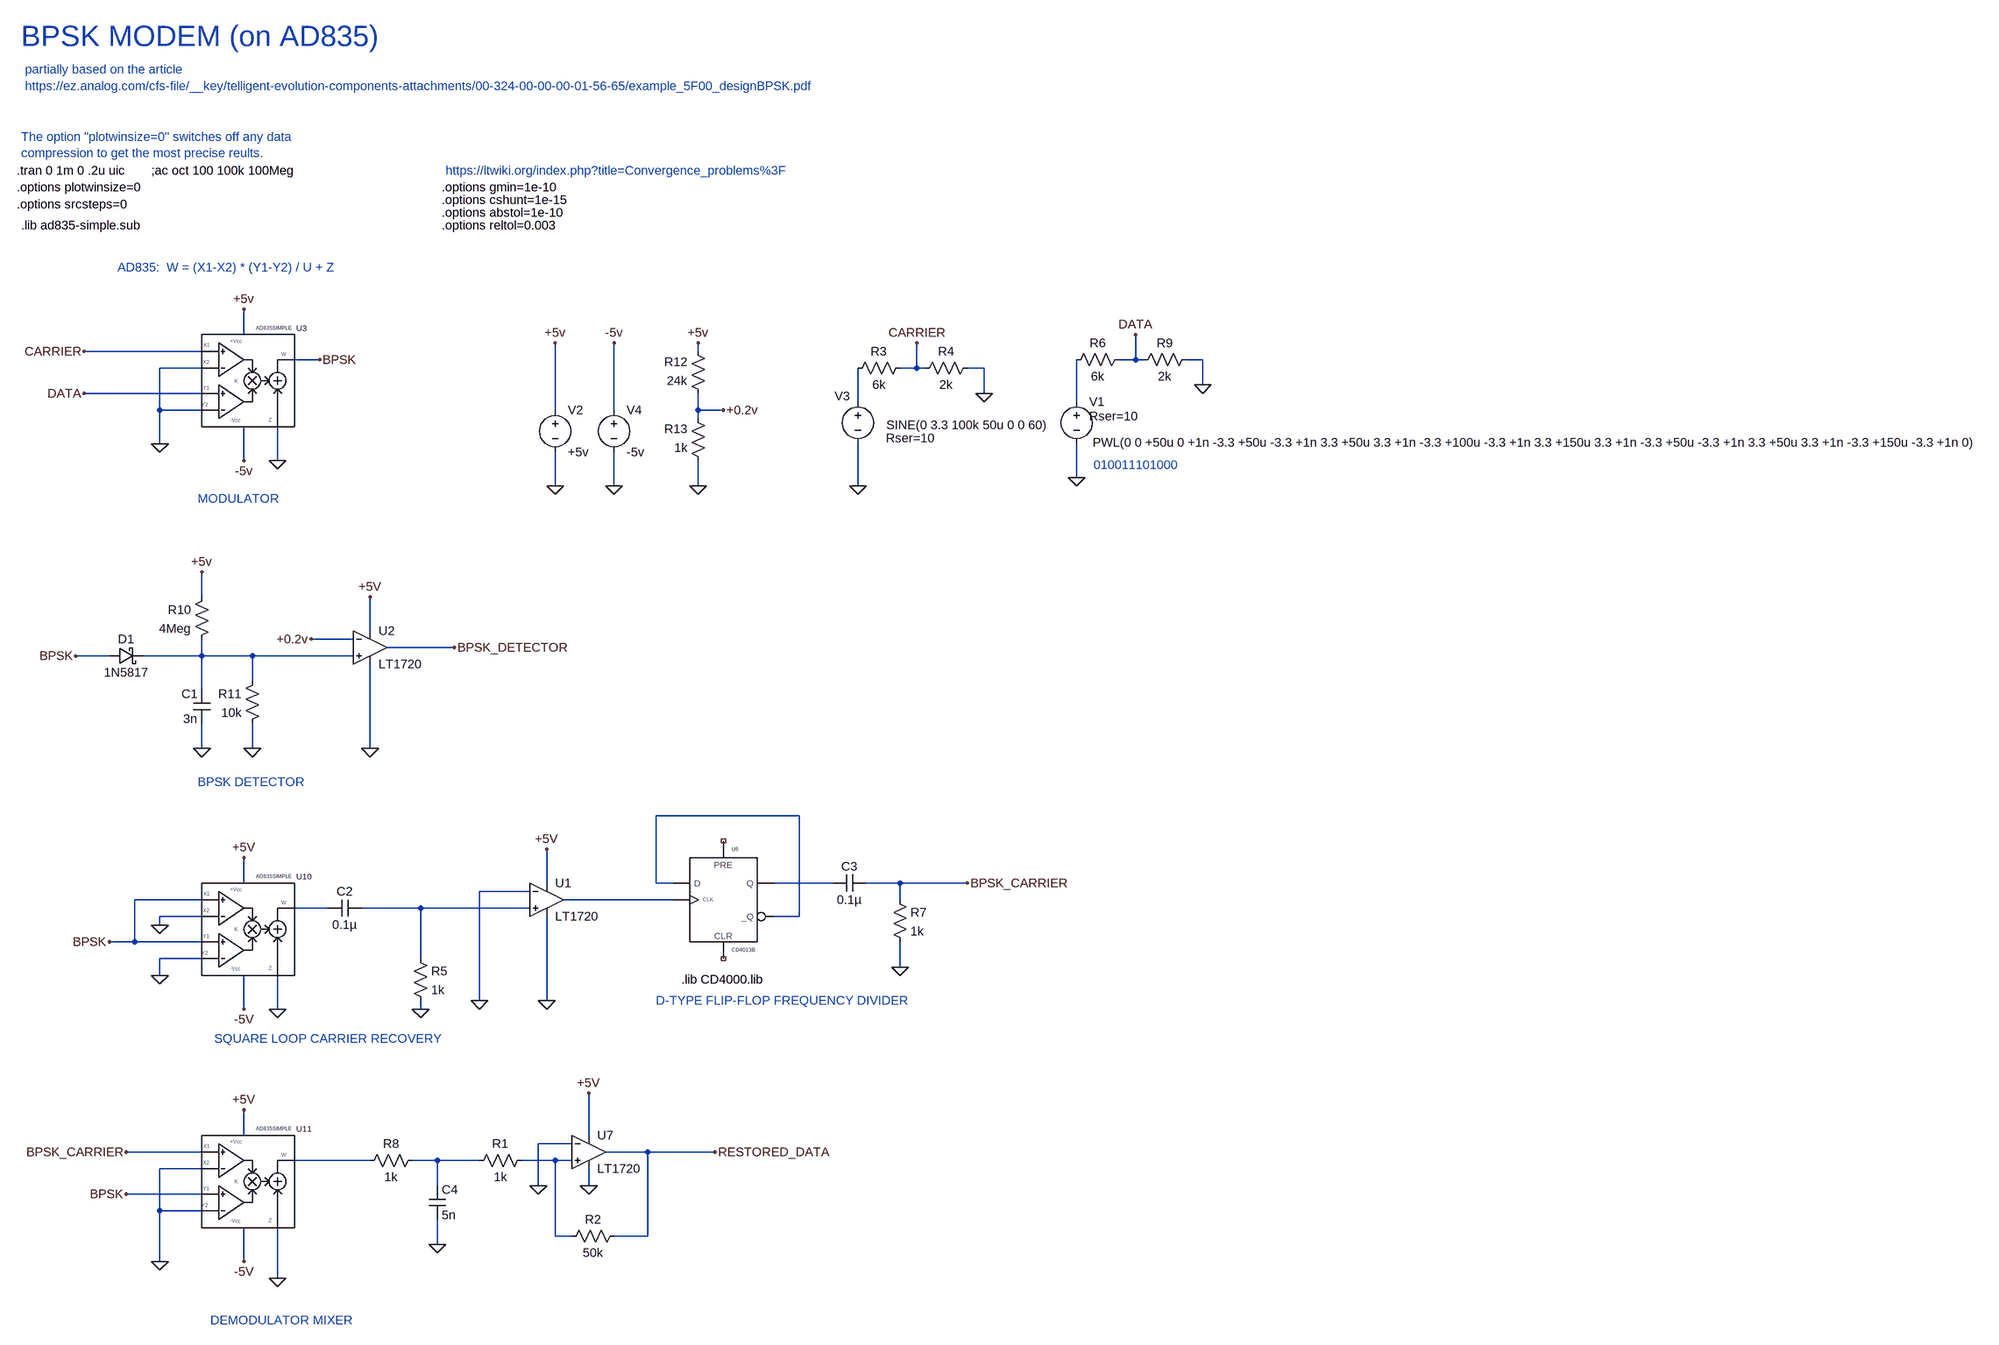
[diagram p0: schematic BPSK-modem-AD835.asc]
BPSK-modem-AD835.asc, the LTspice schematic file:
Version 4
SHEET 1 2952 2612
WIRE -704 416 -704 368
WIRE -784 448 -1008 448
WIRE 160 448 160 432
WIRE -560 464 -608 464
WIRE 992 464 992 416
WIRE 992 464 960 464
WIRE 1008 464 992 464
WIRE 1120 464 1088 464
WIRE -784 480 -864 480
WIRE 576 480 576 432
WIRE 576 480 544 480
WIRE 592 480 576 480
WIRE 704 480 672 480
WIRE 1120 512 1120 464
WIRE -784 528 -1008 528
WIRE 704 528 704 480
WIRE 464 544 464 480
WIRE 880 544 880 464
WIRE -864 560 -864 480
WIRE -784 560 -864 560
WIRE -112 560 -112 432
WIRE 0 560 0 432
WIRE 160 560 160 528
WIRE 208 560 160 560
WIRE 160 576 160 560
WIRE -864 624 -864 560
WIRE -704 656 -704 592
WIRE -640 656 -640 592
WIRE 880 688 880 624
WIRE -112 704 -112 640
WIRE 0 704 0 640
WIRE 160 704 160 656
WIRE 464 704 464 624
WIRE -784 944 -784 896
WIRE -464 1008 -464 944
WIRE -496 1024 -576 1024
WIRE -304 1040 -432 1040
WIRE -960 1056 -1024 1056
WIRE -784 1056 -784 1024
WIRE -784 1056 -896 1056
WIRE -688 1056 -784 1056
WIRE -496 1056 -688 1056
WIRE -688 1104 -688 1056
WIRE -784 1120 -784 1056
WIRE -784 1232 -784 1184
WIRE -688 1232 -688 1184
WIRE -464 1232 -464 1072
WIRE 352 1360 80 1360
WIRE -704 1488 -704 1440
WIRE -128 1488 -128 1424
WIRE 80 1488 80 1360
WIRE 112 1488 80 1488
WIRE 416 1488 304 1488
WIRE 544 1488 480 1488
WIRE 672 1488 544 1488
WIRE -160 1504 -256 1504
WIRE -784 1520 -912 1520
WIRE 112 1520 -96 1520
WIRE 544 1520 544 1488
WIRE -544 1536 -608 1536
WIRE -368 1536 -480 1536
WIRE -160 1536 -368 1536
WIRE -784 1552 -864 1552
WIRE 352 1552 352 1360
WIRE 352 1552 304 1552
WIRE -864 1568 -864 1552
WIRE -912 1600 -912 1520
WIRE -912 1600 -960 1600
WIRE -784 1600 -912 1600
WIRE -784 1632 -864 1632
WIRE -368 1632 -368 1536
WIRE 544 1648 544 1600
WIRE -864 1664 -864 1632
WIRE -256 1712 -256 1504
WIRE -128 1712 -128 1552
WIRE -704 1728 -704 1664
WIRE -640 1728 -640 1664
WIRE -368 1728 -368 1712
WIRE -704 1968 -704 1920
WIRE -48 1968 -48 1888
WIRE -80 1984 -144 1984
WIRE -784 2000 -928 2000
WIRE 64 2000 -16 2000
WIRE 192 2000 64 2000
WIRE -464 2016 -608 2016
WIRE -336 2016 -384 2016
WIRE -256 2016 -336 2016
WIRE -112 2016 -176 2016
WIRE -80 2016 -112 2016
WIRE -784 2032 -864 2032
WIRE -336 2064 -336 2016
WIRE -144 2064 -144 1984
WIRE -48 2064 -48 2032
WIRE -784 2080 -928 2080
WIRE -864 2112 -864 2032
WIRE -784 2112 -864 2112
WIRE -112 2160 -112 2016
WIRE -80 2160 -112 2160
WIRE 64 2160 64 2000
WIRE 64 2160 0 2160
WIRE -336 2176 -336 2128
WIRE -864 2208 -864 2112
WIRE -704 2208 -704 2144
WIRE -640 2240 -640 2144
FLAG -704 368 +5v
FLAG -704 656 -5v
FLAG -864 624 0
FLAG -560 464 BPSK
FLAG -640 656 0
FLAG -112 704 0
FLAG -112 432 +5v
FLAG 0 432 -5v
FLAG 0 704 0
FLAG 464 704 0
FLAG 880 688 0
FLAG -1008 448 CARRIER
FLAG -1008 528 DATA
FLAG -704 1440 +5V
FLAG -704 1728 -5V
FLAG -960 1600 BPSK
FLAG -256 1712 0
FLAG -128 1712 0
FLAG -128 1424 +5V
FLAG -368 1728 0
FLAG -640 2240 0
FLAG -864 2208 0
FLAG -928 2000 BPSK_CARRIER
FLAG -928 2080 BPSK
FLAG -704 2208 -5V
FLAG -704 1920 +5V
FLAG 544 1648 0
FLAG 672 1488 BPSK_CARRIER
FLAG -336 2176 0
FLAG -144 2064 0
FLAG -48 2064 0
FLAG -48 1888 +5V
FLAG 192 2000 RESTORED_DATA
FLAG 704 528 0
FLAG 576 432 CARRIER
FLAG 1120 512 0
FLAG 992 416 DATA
FLAG -864 1568 0
FLAG -864 1664 0
FLAG -640 1728 0
FLAG -784 1232 0
FLAG -784 896 +5v
FLAG -688 1232 0
FLAG 160 704 0
FLAG -464 1232 0
FLAG -464 944 +5V
FLAG 160 432 +5v
FLAG 208 560 +0.2v
FLAG -576 1024 +0.2v
FLAG -1024 1056 BPSK
FLAG -304 1040 BPSK_DETECTOR
SYMBOL voltage 464 528 R0
WINDOW 0 -44 5 Left 2
WINDOW 3 54 60 Left 2
WINDOW 123 -176 131 Left 0
WINDOW 39 53 85 Left 2
SYMATTR InstName V3
SYMATTR Value SINE(0 3.3 100k 50u 0 0 60)
SYMATTR SpiceLine Rser=10
SYMBOL voltage 880 528 R0
WINDOW 123 0 0 Left 0
WINDOW 39 24 44 Left 2
WINDOW 3 31 94 Left 2
SYMATTR SpiceLine Rser=10
SYMATTR Value PWL(0 0 +50u 0 +1n -3.3 +50u -3.3 +1n 3.3 +50u 3.3 +1n -3.3 +100u -3.3 +1n 3.3 +150u 3.3 +1n -3.3 +50u -3.3 +1n 3.3 +50u 3.3 +1n -3.3 +150u -3.3 +1n 0)
SYMATTR InstName V1
SYMBOL voltage -112 544 R0
WINDOW 123 0 0 Left 0
WINDOW 39 0 0 Left 0
SYMATTR InstName V2
SYMATTR Value +5v
SYMBOL voltage 0 544 R0
WINDOW 123 0 0 Left 0
WINDOW 39 0 0 Left 0
SYMATTR InstName V4
SYMATTR Value -5v
SYMBOL ad835-simple -688 496 R0
SYMATTR InstName U3
SYMBOL cap -480 1520 R90
WINDOW 0 0 32 VBottom 2
WINDOW 3 32 32 VTop 2
SYMATTR InstName C2
SYMATTR Value 0.1µ
SYMBOL res -384 1616 R0
SYMATTR InstName R5
SYMATTR Value 1k
SYMBOL Comparators\\LT1720 -128 1456 R0
SYMATTR InstName U1
SYMBOL CD4000\\CD4013B 208 1408 R0
SYMATTR InstName U6
SYMBOL cap 480 1472 R90
WINDOW 0 0 32 VBottom 2
WINDOW 3 32 32 VTop 2
SYMATTR InstName C3
SYMATTR Value 0.1µ
SYMBOL res 528 1504 R0
SYMATTR InstName R7
SYMATTR Value 1k
SYMBOL res -368 2000 R90
WINDOW 0 0 56 VBottom 2
WINDOW 3 32 56 VTop 2
SYMATTR InstName R8
SYMATTR Value 1k
SYMBOL cap -352 2064 R0
SYMATTR InstName C4
SYMATTR Value 5n
SYMBOL Comparators\\LT1720 -48 1936 R0
SYMATTR InstName U7
SYMBOL ad835-simple -688 1568 R0
SYMATTR InstName U10
SYMBOL ad835-simple -688 2048 R0
SYMATTR InstName U11
SYMBOL res 16 2144 R90
WINDOW 0 0 56 VBottom 2
WINDOW 3 32 56 VTop 2
SYMATTR InstName R2
SYMATTR Value 50k
SYMBOL res -160 2000 R90
WINDOW 0 0 56 VBottom 2
WINDOW 3 32 56 VTop 2
SYMATTR InstName R1
SYMATTR Value 1k
SYMBOL res 560 464 R90
WINDOW 0 0 56 VBottom 2
WINDOW 3 32 56 VTop 2
SYMATTR InstName R3
SYMATTR Value 6k
SYMBOL res 688 464 R90
WINDOW 0 0 56 VBottom 2
WINDOW 3 32 56 VTop 2
SYMATTR InstName R4
SYMATTR Value 2k
SYMBOL res 976 448 R90
WINDOW 0 0 56 VBottom 2
WINDOW 3 32 56 VTop 2
SYMATTR InstName R6
SYMATTR Value 6k
SYMBOL res 1104 448 R90
WINDOW 0 0 56 VBottom 2
WINDOW 3 32 56 VTop 2
SYMATTR InstName R9
SYMATTR Value 2k
SYMBOL schottky -960 1040 M90
WINDOW 0 0 32 VBottom 2
WINDOW 3 32 32 VTop 2
SYMATTR InstName D1
SYMATTR Value 1N5817
SYMBOL res -768 928 M0
SYMATTR InstName R10
SYMATTR Value 4Meg
SYMBOL cap -768 1120 M0
SYMATTR InstName C1
SYMATTR Value 3n
SYMBOL res -672 1088 M0
SYMATTR InstName R11
SYMATTR Value 10k
SYMBOL Comparators\\LT1720 -464 976 R0
SYMATTR InstName U2
SYMBOL res 176 544 R180
WINDOW 0 36 76 Left 2
WINDOW 3 36 40 Left 2
SYMATTR InstName R12
SYMATTR Value 24k
SYMBOL res 176 672 R180
WINDOW 0 36 76 Left 2
WINDOW 3 36 40 Left 2
SYMATTR InstName R13
SYMATTR Value 1k
TEXT -1128 40 Left 2 ;The option "plotwinsize=0" switches off any data \ncompression to get the most precise reults.
TEXT -1136 136 Left 2 !.options plotwinsize=0
TEXT -944 288 Left 2 ;AD835:  W = (X1-X2) * (Y1-Y2) / U + Z
TEXT -1136 104 Left 2 !.tran 0 1m 0 .2u uic
TEXT -1120 -88 Left 2 ;partially based on the article\nhttps://ez.analog.com/cfs-file/__key/telligent-evolution-components-attachments/00-324-00-00-00-01-56-65/example_5F00_designBPSK.pdf
TEXT -1136 168 Left 2 !.options srcsteps=0
TEXT -1128 208 Left 2 !.lib ad835-simple.sub
TEXT -328 184 Left 2 !.options abstol=1e-10
TEXT -328 136 Left 2 !.options gmin=1e-10
TEXT -328 208 Left 2 !.options reltol=0.003
TEXT -328 160 Left 2 !.options cshunt=1e-15
TEXT -320 104 Left 2 ;https://ltwiki.org/index.php?title=Convergence_problems%3F
TEXT 128 1672 Left 2 !.lib CD4000.lib
TEXT -792 728 Left 2 ;MODULATOR
TEXT -760 1784 Left 2 ;SQUARE LOOP CARRIER RECOVERY
TEXT 80 1712 Left 2 ;D-TYPE FLIP-FLOP FREQUENCY DIVIDER
TEXT -768 2320 Left 2 ;DEMODULATOR MIXER
TEXT -880 104 Left 2 !;ac oct 100 100k 100Meg
TEXT 912 664 Left 2 ;010011101000
TEXT -792 1296 Left 2 ;BPSK DETECTOR
TEXT -1128 -152 Left 5 ;BPSK MODEM (on AD835)

The netlist it stands for:
* BPSK-modem-AD835.asc
V3 N001 0 SINE(0 3.3 100k 50u 0 0 60) Rser=10
V1 N002 0 PWL(0 0 +50u 0 +1n -3.3 +50u -3.3 +1n 3.3 +50u 3.3 +1n -3.3 +100u -3.3 +1n 3.3 +150u 3.3 +1n -3.3 +50u -3.3 +1n 3.3 +50u 3.3 +1n -3.3 +150u -3.3 +1n 0) Rser=10
V2 +5v 0 +5v
V4 -5v 0 -5v
XU3 CARRIER 0 DATA 0 -5v 0 BPSK +5v AD835SIMPLE  ; pins X1 X2 Y1 Y2 VN Z W VP
C2 N008 N007 0.1µ
R5 N008 0 1k
XU1 N008 0 +5v 0 N006 LT1720  ; pins In+ In- V+ V- OUT
XU6 NC_01 N006 N004 NC_02 N005 N004 VDD 0 CD4013B VDD=5  SPEED=1.0  TRIPDT=5e-9  ; pins PRE CP D CLR Q _Q
C3 BPSK_CARRIER N005 0.1µ
R7 BPSK_CARRIER 0 1k
R8 N010 N009 1k
C4 N010 0 5n
XU7 N011 0 +5v 0 RESTORED_DATA LT1720  ; pins In+ In- V+ V- OUT
XU10 BPSK 0 BPSK 0 -5v 0 N007 +5v AD835SIMPLE  ; pins X1 X2 Y1 Y2 VN Z W VP
XU11 BPSK_CARRIER 0 BPSK 0 -5v 0 N009 +5v AD835SIMPLE  ; pins X1 X2 Y1 Y2 VN Z W VP
R2 RESTORED_DATA N011 50k
R1 N011 N010 1k
R3 CARRIER N001 6k
R4 0 CARRIER 2k
R6 DATA N002 6k
R9 0 DATA 2k
D1 BPSK N003 1N5817
R10 +5v N003 4Meg
C1 N003 0 3n
R11 N003 0 10k
XU2 N003 +0.2v +5v 0 BPSK_DETECTOR LT1720  ; pins In+ In- V+ V- OUT
R12 +0.2v +5v 24k
R13 0 +0.2v 1k
.model D D
.lib standard.dio
* The option "plotwinsize=0" switches off any data
* compression to get the most precise reults.
.options plotwinsize=0
* AD835:  W = (X1-X2) * (Y1-Y2) / U + Z
.tran 0 1m 0 .2u uic
* partially based on the article
* https://ez.analog.com/cfs-file/__key/telligent-evolution-components-attachments/00-324-00-00-00-01-56-65/example_5F00_designBPSK.pdf
.options srcsteps=0
.lib ad835-simple.sub
.options abstol=1e-10
.options gmin=1e-10
.options reltol=0.003
.options cshunt=1e-15
* https://ltwiki.org/index.php?title=Convergence_problems%3F
.lib CD4000.lib
* MODULATOR
* SQUARE LOOP CARRIER RECOVERY
* D-TYPE FLIP-FLOP FREQUENCY DIVIDER
* DEMODULATOR MIXER
;ac oct 100 100k 100Meg
* 010011101000
* BPSK DETECTOR
* BPSK MODEM (on AD835)
.lib LT1720.sub
.backanno
.end